# EAGLE schematic EYIC AD1 (EAGLE 9.6.2)
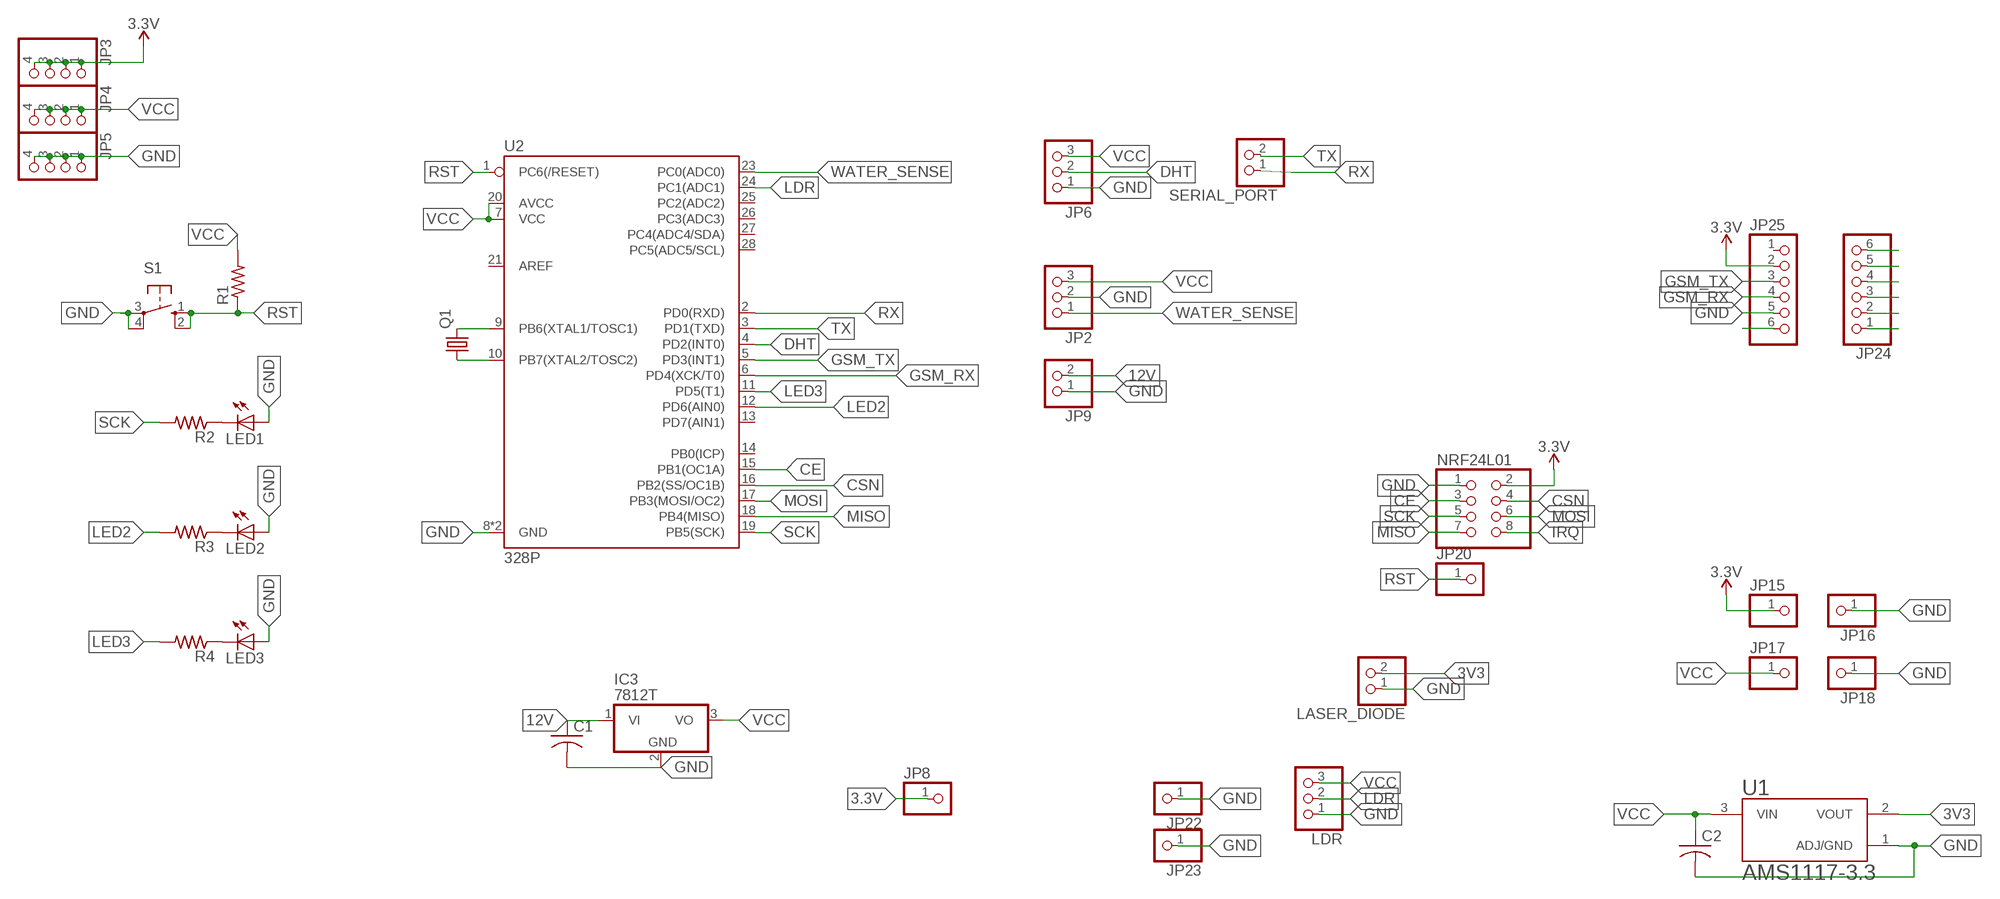
[diagram p0: schematic, sheet 1]

## Parts
C1  C-US050-035X075  [C050-035X075]
C2  C-US025-060X050  [C025-060X050]
IC3  7812T  [TO220H]
JP2  PINHD-1X3  [1X03]
JP3  PINHD-1X4  [1X04]
JP4  PINHD-1X4  [1X04]
JP5  PINHD-1X4  [1X04]
JP6  PINHD-1X3  [1X03]
JP8  PINHD-1X1  [1X01]
JP9  PINHD-1X2  [1X02]
JP15  PINHD-1X1  [1X01]
JP16  PINHD-1X1  [1X01]
JP17  PINHD-1X1  [1X01]
JP18  PINHD-1X1  [1X01]
JP20  PINHD-1X1  [1X01]
JP22  PINHD-1X1  [1X01]
JP23  PINHD-1X1  [1X01]
JP24  PINHD-1X6  [1X06]
JP25  PINHD-1X6  [1X06]
LASER_DIODE  PINHD-1X2  [1X02]
LDR  PINHD-1X3  [1X03]
LED1  LED5MM  [LED5MM]
LED2  LED5MM  [LED5MM]
LED3  LED5MM  [LED5MM]
NRF24L01  PINHD-2X4  [2X04]
Q1  CRYSTALHC49S  [HC49/S]
R1  R-US_0207/7  [0207/7]
R2  R-US_0207/7  [0207/7]
R3  R-US_0207/7  [0207/7]
R4  R-US_0207/7  [0207/7]
S1  10-XX  [B3F-10XX]
SERIAL_PORT  PINHD-1X2  [1X02]
U1  AMS1117-3.3  [SOT229P700X180-4N]
U2  328P  ATMEGA328P_PDIP  [DIP28]

## Nets
3.3V: JP3.1 JP3.2 JP3.3 JP3.4 JP8.1 JP15.1 JP25.2 NRF24L01.2
3V3: LASER_DIODE.2 U1.2(VOUT)
12V: C1.1 IC3.1(VI) JP9.2
CE: NRF24L01.3 U2.15(PB1(OC1A))
CSN: NRF24L01.4 U2.16(PB2(SS/OC1B))
DHT: JP6.2 U2.4(PD2(INT0))
GND: C1.2 C2.2 IC3.2(GND) JP2.2 JP5.1 JP5.2 JP5.3 JP5.4 JP6.1 JP9.1 JP16.1 JP18.1 JP22.1 JP23.1 JP25.5 LASER_DIODE.1 LDR.1 LED1.A LED2.A LED3.A NRF24L01.1 S1.3(P) S1.4(P1) U1.1(ADJ/GND) U2.8(GND) U2.22(GND)
GSM_RX: JP25.4 U2.6(PD4(XCK/T0))
GSM_TX: JP25.3 U2.5(PD3(INT1))
IRQ: NRF24L01.8
LDR: LDR.2 U2.24(PC1(ADC1))
LED2: R3.2 U2.12(PD6(AIN0))
LED3: R4.2 U2.11(PD5(T1))
MISO: NRF24L01.7 U2.18(PB4(MISO))
MOSI: NRF24L01.6 U2.17(PB3(MOSI/OC2))
N$1: Q1.2 U2.9(PB6(XTAL1/TOSC1))
N$2: Q1.1 U2.10(PB7(XTAL2/TOSC2))
N$5: LED1.K(C) R2.1
N$8: LED2.K(C) R3.1
N$9: LED3.K(C) R4.1
N$11: JP25.6
N$12: JP24.6
N$13: JP24.5
N$14: JP24.4
N$15: JP24.3
N$16: JP24.2
N$17: JP24.1
RST: JP20.1 R1.1 S1.1(S) S1.2(S1) U2.1(PC6(/RESET))
RX: SERIAL_PORT.1 U2.2(PD0(RXD))
SCK: NRF24L01.5 R2.2 U2.19(PB5(SCK))
TX: SERIAL_PORT.2 U2.3(PD1(TXD))
VCC: C2.1 IC3.3(VO) JP2.3 JP4.1 JP4.2 JP4.3 JP4.4 JP6.3 JP17.1 LDR.3 R1.2 U1.3(VIN) U2.7(VCC) U2.20(AVCC)
WATER_SENSE: JP2.1 U2.23(PC0(ADC0))
Unconnected: JP25.1 U2.13(PD7(AIN1)) U2.14(PB0(ICP)) U2.21(AREF) U2.25(PC2(ADC2)) U2.26(PC3(ADC3)) U2.27(PC4(ADC4/SDA)) U2.28(PC5(ADC5/SCL))

## Library data of the parts
C1 C2 = adafruit:C-US: CAPACITOR, American symbol
IC3 = adafruit:78*: Positive VOLTAGE REGULATOR Added bigger pads to the TO-92 package
JP2 JP6 LDR = adafruit:PINHD-1X3: PIN HEADER
JP3-JP5 = pinhead:PINHD-1X4: PIN HEADER
JP8 JP15-JP18 JP20 JP22 JP23 = adafruit:PINHD-1X1: Pin header 1x1 for 0.1" spacing With round pins
JP9 LASER_DIODE SERIAL_PORT = pinhead:PINHD-1X2: PIN HEADER
JP24 JP25 = adafruit:PINHD-1X6: PIN HEADER; SPICEPREFIX: X
LED1-LED3 = adafruit:LED: LED OSRAM: - CHIPLED LG R971, LG N971, LY N971, LG Q971, LY Q971, LO R971, LY R971 LH N974, LH R974 LS Q976, LO Q976, LY Q976 LO Q996 - Hyper CHIPLED LW Q18S LB Q993, LB Q99A, LB R99A - SideLED LS A670, LO A670, LY A670, LG A670, LP A670 LB A673, LV A673, LT A673, LW A673 LH A674 LY A675 LS A676, LA A676, LO A676, LY A676, LW A676 LS A679, LY A679, LG A679 - Hyper Micro SIDELED® LS Y876, LA Y876, LO Y876, LY Y876 LT Y87S - SmartLED LW L88C, LW L88S LB L89C, LB L89S, LG L890 LS L89K, LO L89K, LY L89K LS L896, LA L896, LO L896, LY L896 - TOPLED LS T670, LO T670, LY T670, LG T670, LP T670 LSG T670, LSP T670, LSY T670, LOP T670, LYG T670 LG T671, LOG T671, LSG T671 LB T673, LV T673, LT T673, LW T673 LH T674 LS T676, LA T676, LO T676, LY T676, LB T676, LH T676, LSB T676, LW T676 LB T67C, LV T67C, LT T67C, LS T67K, LO T67K, LY T67K, LW E67C LS E67B, LA E67B, LO E67B, LY E67B, LB E67C, LV E67C, LT E67C LW T67C LS T679, LY T679, LG T679 LS T770, LO T770, LY T770, LG T770, LP T770 LB T773, LV T773, LT T773, LW T773 LH T774 LS E675, LA E675, LY E675, LS T675 LS T776, LA T776, LO T776, LY T776, LB T776 LHGB T686 LT T68C, LB T68C - Hyper Mini TOPLED® LB M676 - Mini TOPLED Santana® LG M470 LS M47K, LO M47K, LY M47K Source: http://www.osram.convergy.de/
NRF24L01 = adafruit:PINHD-2X4: PIN HEADER
Q1 = crystal:CRYSTAL: CRYSTAL; OC_FARNELL: 1667008; OC_NEWARK: unknown
R1-R4 = adafruit:R-US_: RESISTOR, American symbol
S1 = switch-omron:10-XX: OMRON SWITCH; MPN: B3F-1000; OC_FARNELL: 176432; OC_NEWARK: 36M3542
U1 = AMS1117-3.3:AMS1117-3.3: Sot223/Pkg 1-Amp 3.3-Volt Low Drop Out Voltage Regulatator; AVAILABILITY: Unavailable; DESCRIPTION: Sot-89; MF: Advanced Monolithic Systems; MP: AMS1117-3.3; PACKAGE: SOT-89 ams; PRICE: None
U2 = SparkFun-IC-Microcontroller:ATMEGA328P_PDIP: Atmel 328P Through hole ATMEGA328P uC used in the Arduino 32kb flash, 1k EEPROM, 2k SRAM Datasheet <http://www.sparkfun.com/datasheets/Components/SMD/ATMega328.pdf> SparkFun Products Storefront component: AVR 28 Pin 20MHz 32K 6A/D - ATMega328P <https://www.sparkfun.com/products/9061> (COM-09061) SparkFun Simon Says - Through-Hole Soldering Kit <https://www.sparkfun.com/products/10547> (KIT-10547) SparkFun Learn to Solder - Simon Says <https://www.sparkfun.com/products/13708> (KIT-13708) SparkFun BigTime Watch Kit <https://www.sparkfun.com/products/11734> (KIT-11734) SparkFun ClockIt <https://www.sparkfun.com/products/10930> (KIT-10930) SparkFun Serial Enabled LCD Kit <https://www.sparkfun.com/products/10097> (LCD-10097) SparkFun Simon Tilts - Through Hole Soldering Kit <https://www.sparkfun.com/products/12634> (KIT-12634) SparkFun Frequency Counter Kit <https://www.sparkfun.com/products/10140> (KIT-10140) FabFM Radio Kit <https://www.sparkfun.com/products/11043> (KIT-11043) SparkFun Binary Blaster Kit <https://www.sparkfun.com/products/12037> (KIT-12037) SparkFun Metro-Gnome <https://www.sparkfun.com/products/9236> (KIT-09236) ATmega328 with Arduino Optiboot (Uno) <https://www.sparkfun.com/products/10524> (DEV-10524); PROD_ID: IC-09136